# Altium schematic sheet PiCarHat_Master_V2.SchDoc
size A2; SheetNumber: 1; SheetTotal: 1; SPICEModelCacheWKMVAURK: <root> / <DocumentId>WKMVAURK</DocumentId> / </root>
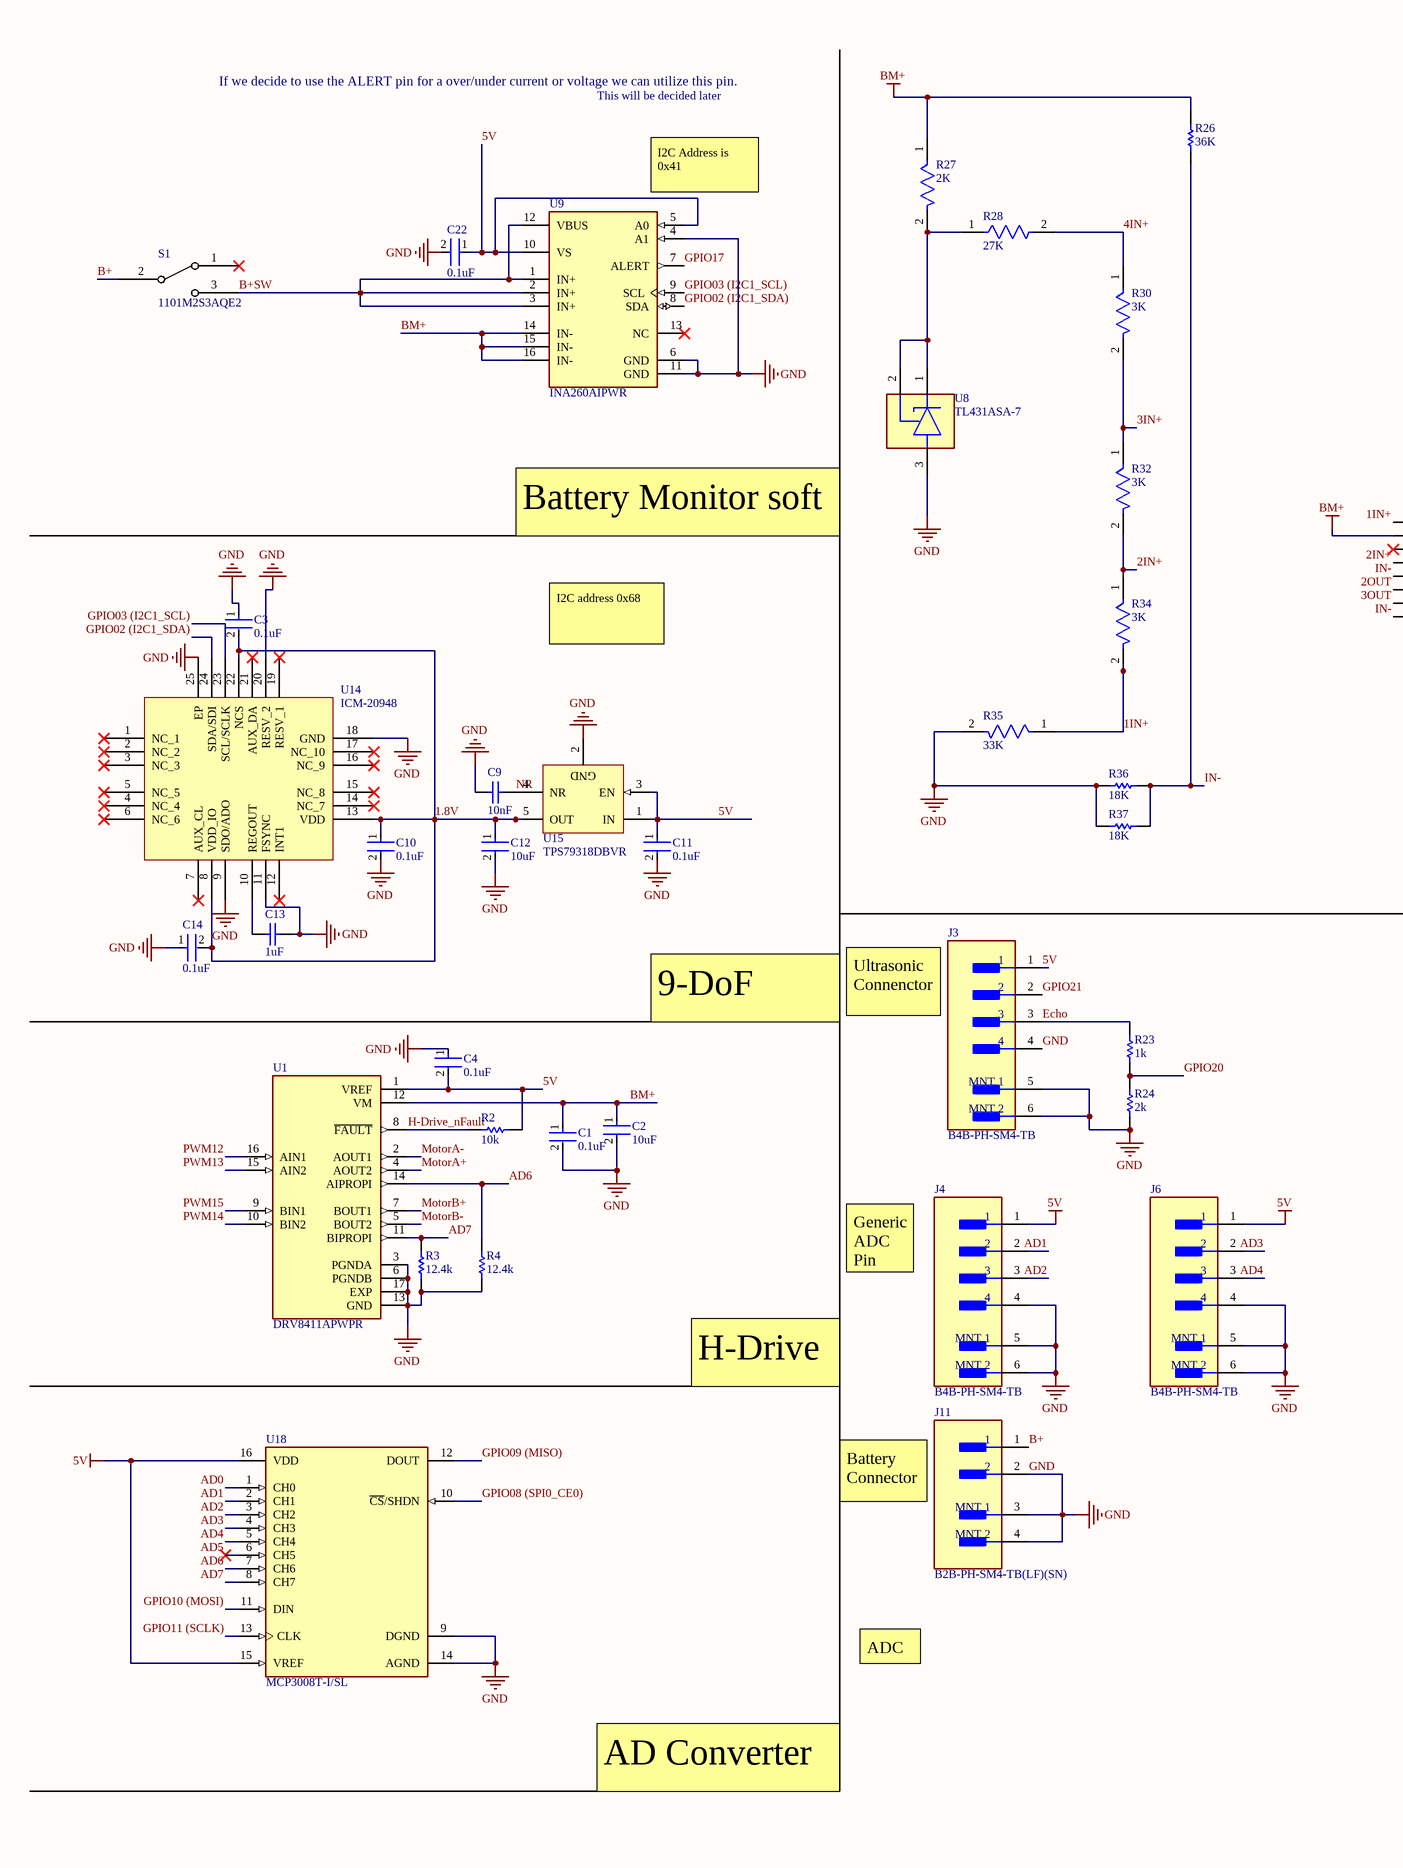
[diagram p0: PiCarHat_Master_V2.SchDoc, left]
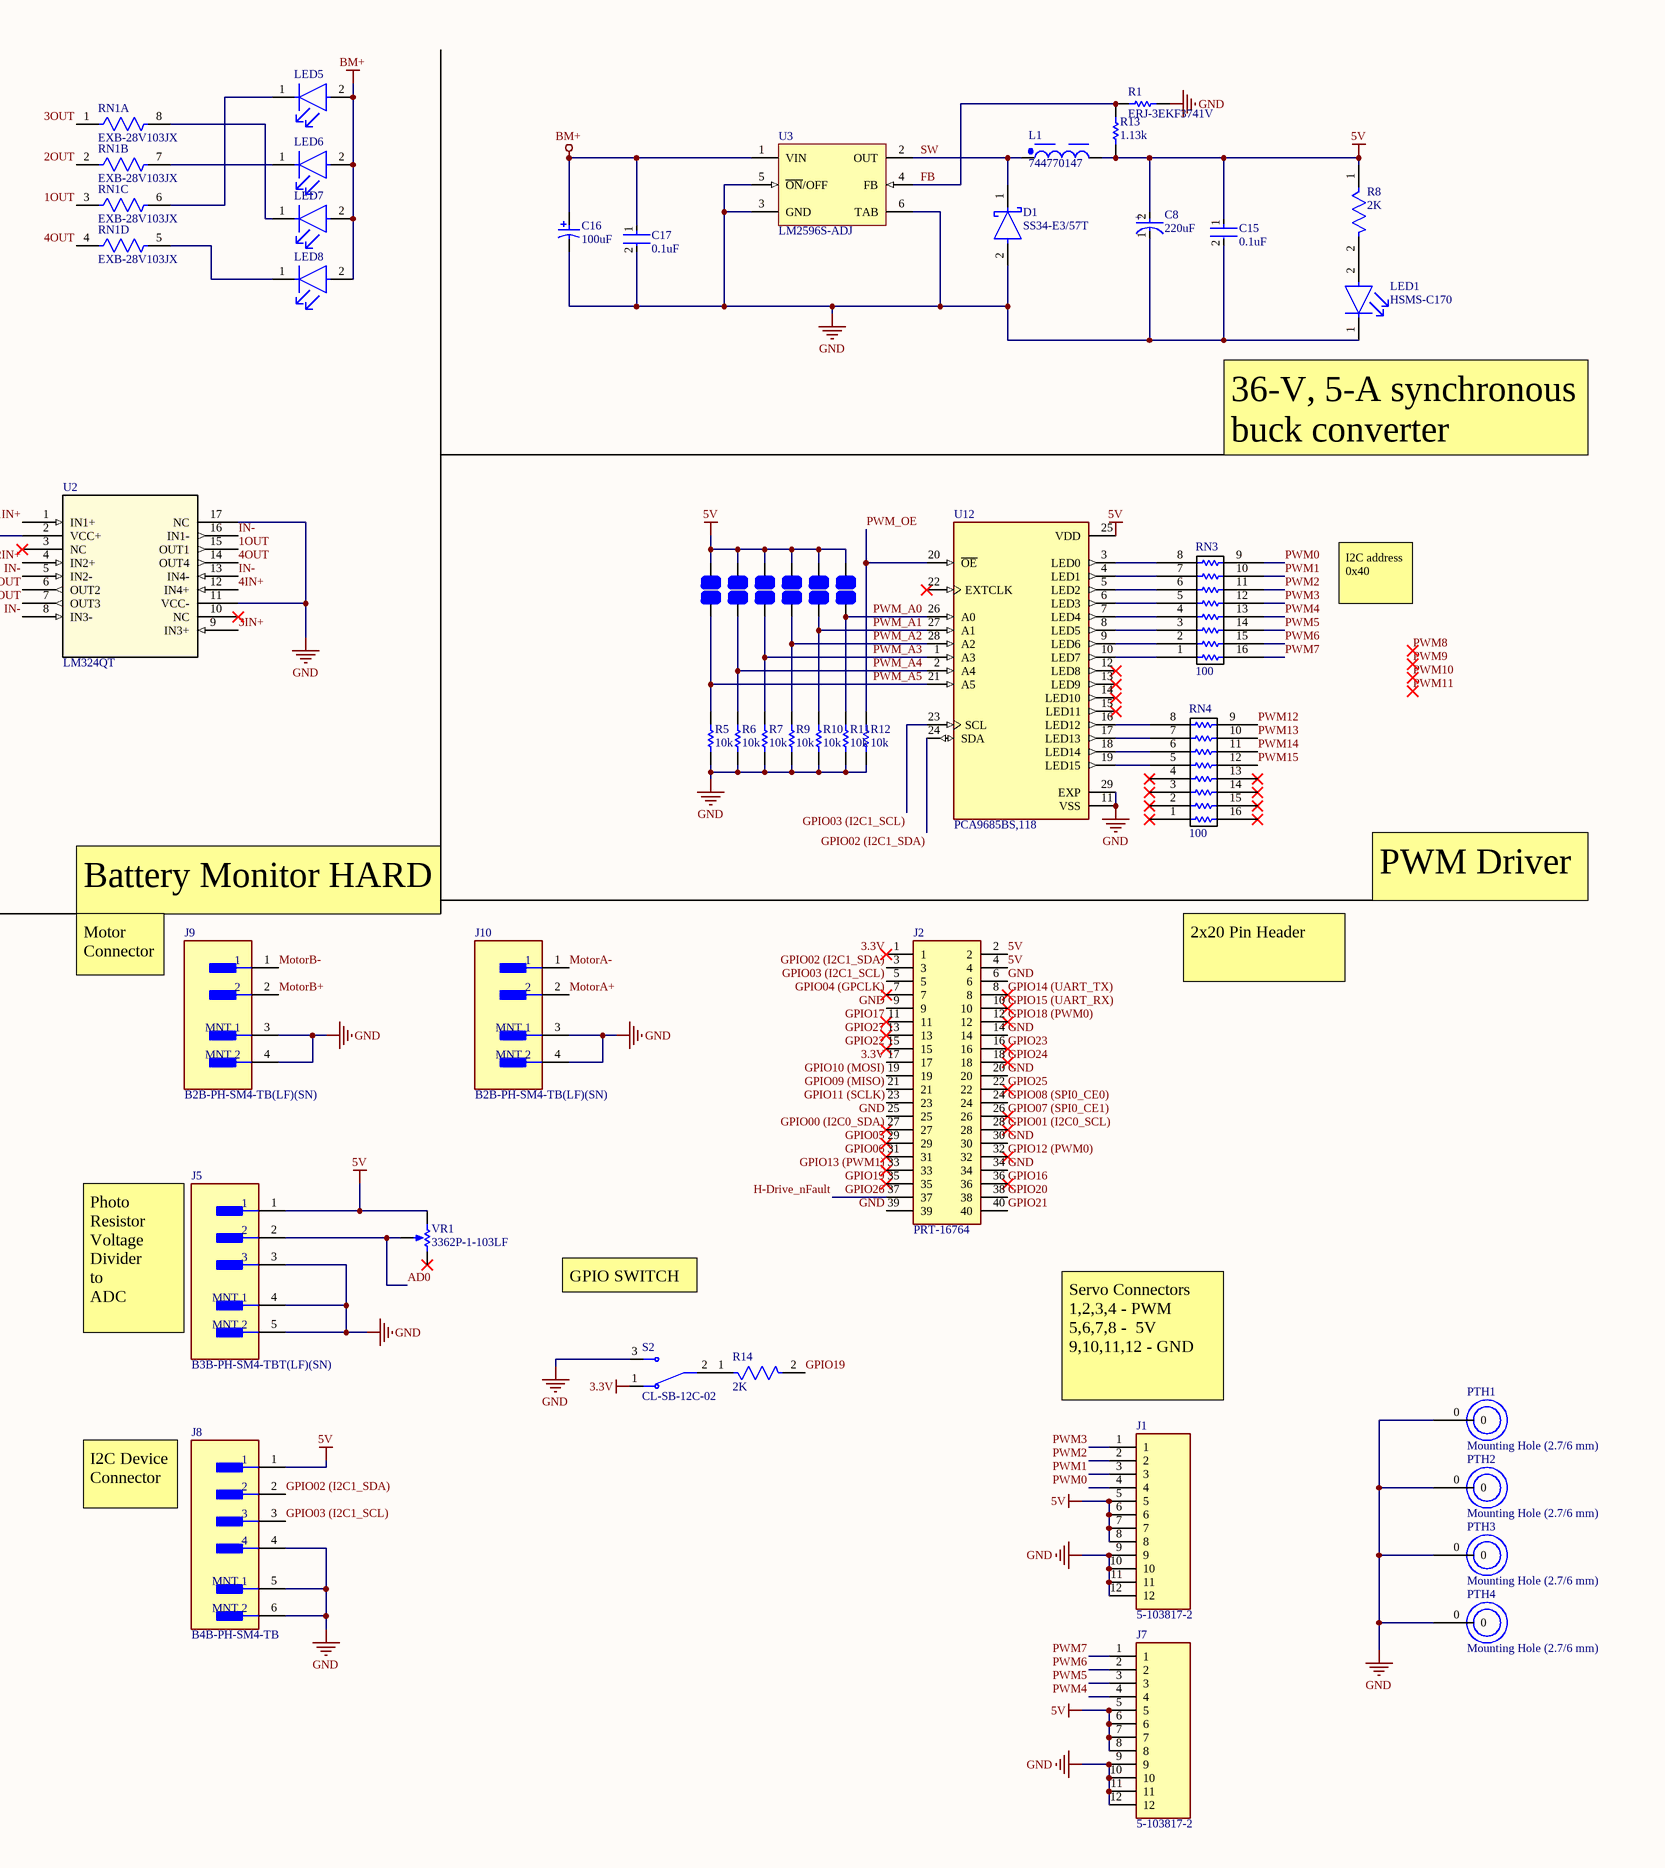
[diagram p1: PiCarHat_Master_V2.SchDoc, right]

## Parts
C1  0.1uF  [FP-C1206C-EB-MFG]
C2  10uF  [FP-GRM21B-0_15-IPC_C]
C3  0.1uF  [FP-C1206C-EB-MFG]
C4  0.1uF  [FP-C1206C-EB-MFG]
C8  220uF  [FP-FKG-MFG]
C9  10nF  [CAPC2013X100X50NL20T25]
C10  0.1uF  [FP-C1206C-EB-MFG]
C11  0.1uF  [FP-C1206C-EB-MFG]
C12  10uF  [FP-GRM21B-0_15-IPC_C]
C13  1uF  [CAPC2013X140X50LL20T25]
C14  0.1uF  [FP-C1206C-EB-MFG]
C15  0.1uF  [FP-C1206C-EB-MFG]
C16  100uF  [PNSC-FK-V-D8_V]
C17  0.1uF  [FP-C1206C-EB-MFG]
C22  0.1uF  [FP-C1206C-EB-MFG]
D1  SS34-E3/57T  [FP-95402-MFG]
J1  5-103817-2  [TE_5-103817-2]
J2  PRT-16764  [RHDR40W64P254_2X20_5130X500X1375P]
J3  B4B-PH-SM4-TB  [FP-B4B-PH-SM4-TB-MFG]
J4  B4B-PH-SM4-TB  [FP-B4B-PH-SM4-TB-MFG]
J5  B3B-PH-SM4-TBT(LF)(SN)  [FP-B3B-PH-SM4-TBT_LF_SN-MFG]
J6  B4B-PH-SM4-TB  [FP-B4B-PH-SM4-TB-MFG]
J7  5-103817-2  [TE_5-103817-2]
J8  B4B-PH-SM4-TB  [FP-B4B-PH-SM4-TB-MFG]
J9  B2B-PH-SM4-TB(LF)(SN)  [FP-B2B-PH-SM4-TB_LF_SN-MFG]
J10  B2B-PH-SM4-TB(LF)(SN)  [FP-B2B-PH-SM4-TB_LF_SN-MFG]
J11  B2B-PH-SM4-TB(LF)(SN)  [FP-B2B-PH-SM4-TB_LF_SN-MFG]
L1  744770147  [WE-PD_1280]
LED1  HSMS-C170  [HSMS-C170-Footprint-1]
LED5  HSMS-C170  [HSMS-C170-Footprint-1]  (value not drawn)
LED6  HSMS-C170  [HSMS-C170-Footprint-1]  (value not drawn)
LED7  HSMS-C170  [HSMS-C170-Footprint-1]  (value not drawn)
LED8  HSMS-C170  [HSMS-C170-Footprint-1]  (value not drawn)
PD1  0805 Solder pads, 51mil x 28mil, Gap 47 mil  [0805 Solder Pads]  (value not drawn)
PD2  0805 Solder pads, 51mil x 28mil, Gap 47 mil  [0805 Solder Pads]  (value not drawn)
PD3  0805 Solder pads, 51mil x 28mil, Gap 47 mil  [0805 Solder Pads]  (value not drawn)
PD4  0805 Solder pads, 51mil x 28mil, Gap 47 mil  [0805 Solder Pads]  (value not drawn)
PD5  0805 Solder pads, 51mil x 28mil, Gap 47 mil  [0805 Solder Pads]  (value not drawn)
PD6  0805 Solder pads, 51mil x 28mil, Gap 47 mil  [0805 Solder Pads]  (value not drawn)
PTH1  Mounting Hole (2.7/6 mm)  [New footprint 1]
PTH2  Mounting Hole (2.7/6 mm)  [New footprint 1]
PTH3  Mounting Hole (2.7/6 mm)  [New footprint 1]
PTH4  Mounting Hole (2.7/6 mm)  [New footprint 1]
R1  ERJ-3EKF3741V  [RESC1608X55X30LL15T15]
R2  10k  [RESC1608X55X25LL10T15]
R3  12.4k  [RESC2013X60X35NL10T20]
R4  12.4k  [RESC2013X60X35NL10T20]
R5  10k  [RESC1608X55X25ML10T15]
R6  10k  [RESC1608X55X25ML10T15]
R7  10k  [RESC1608X55X25ML10T15]
R8  2K  [FP-CRCW0805-e3-MFG]
R9  10k  [RESC1608X55X25ML10T15]
R10  10k  [RESC1608X55X25ML10T15]
R11  10k  [RESC1608X55X25ML10T15]
R12  10k  [RESC1608X55X25ML10T15]
R13  1.13k  [RESC1609X50X30NL10T20]
R14  2K  [FP-CRCW0805-e3-MFG]
R23  1k  [RESC1609X55X30LL10T20]
R24  2k  [RESC1609X55X30LL10T20]
R26  36K  [RESC2113X50X35ML15T15]
R27  2K  [FP-CRCW0805-e3-IPC_B]
R28  27K  [FP-CRCW0805-e3-MFG]
R30  3K  [FP-CRCW0805-e3-IPC_C]
R32  3K  [FP-CRCW0805-e3-IPC_C]
R34  3K  [FP-CRCW0805-e3-IPC_C]
R35  33K  [FP-CRCW0805-e3-IPC_B]
R36  18K  [RESC2013X50X30NL20T20]
R37  18K  [RESC2013X50X30NL20T20]
RN1  EXB-28V103JX  [FP-EXB28V-MFG]  (parts A,B,C,D of 4)
RN3  value 100  [YC248-JR-07100RL-Footprint-2]  (hidden comment: YC248-JR-07100RL)
RN4  value 100  [YC248-JR-07100RL-Footprint-2]  (hidden comment: YC248-JR-07100RL)
S1  1101M2S3AQE2  [1101M2S3AQE2-Footprint-1]
S2  CL-SB-12C-02  [CL-SB-12C-02-Footprint-1]
U1  DRV8411APWPR  [IC_DRV8411APWPR]
U2  LM324QT  [LM324QT-Footprint-1]
U3  LM2596S-ADJ  [TS5B_L]
U8  TL431ASA-7  [FP-SOT23-MFG]
U9  INA260AIPWR  [FP-PW0016A-MFG]
U12  PCA9685BS,118  [QFN65P600X600X100-29N]
U14  ICM-20948  [TDK-QFN-24_L]
U15  TPS79318DBVR  [DBV0005A_M]
U18  MCP3008T-I/SL  [FP-C04-108-MFG]
VR1  3362P-1-103LF  [BOUR-3362P]

## Nets
3.3V: J2.1 J2.17 S2.1(NC)
5V: C4.2 C8.2(A) C11.1 C15.1 C22.1 J1.5 J1.6 J1.7 J1.8 J2.2 J2.4 J3.1 J4.1 J5.1 J6.1 J7.5 J7.6 J7.7 J7.8 J8.1 L1.2 PD1.2 PD2.2 PD3.2 PD4.2 PD5.2 PD6.2 R2.1 R8.1 R13.1 U1.1(VREF) U9.5(A0) U9.10(VS) U12.25(VDD) U15.1(IN) U15.3(EN) U18.15(VREF) U18.16(VDD) VR1.1(CCW)
BM+: C1.1 C2.1 C16.1 C17.1 LED5.2(A) LED6.2(A) LED7.2(A) LED8.2(A) R26.2 R27.1 U1.12(VM) U2.2(VCC+) U3.1(VIN) U9.14(IN-) U9.15(IN-) U9.16(IN-)
GND: C1.2 C2.2 C3.1 C4.1 C8.1(C) C9.1 C10.2 C11.2 C12.2 C13.2 C14.1 C15.2 C16.2 C17.2 C22.2 D1.2(A) J1.9 J1.10 J1.11 J1.12 J2.6 J2.9 J2.14 J2.20 J2.25 J2.30 J2.34 J2.39 J3.4 J3.5(MNT_1) J3.6(MNT_2) J4.4 J4.5(MNT_1) J4.6(MNT_2) J5.3 J5.4(MNT_1) J5.5(MNT_2) J6.4 J6.5(MNT_1) J6.6(MNT_2) J7.9 J7.10 J7.11 J7.12 J8.4 J8.5(MNT_1) J8.6(MNT_2) J9.3(MNT_1) J9.4(MNT_2) J10.3(MNT_1) J10.4(MNT_2) J11.2 J11.3(MNT_1) J11.4(MNT_2) LED1.1(C) PTH1.0 PTH2.0 PTH3.0 PTH4.0 R1.2 R3.1 R4.1 R5.1 R6.1 R7.1 R9.1 R10.1 R11.1 R12.1 R24.2 R35.2 R36.1 R37.1 S2.3(NO) U1.3(PGNDA) U1.6(PGNDB) U1.13(GND) U1.17(EXP) U2.11(VCC-) U2.17(NC) U3.3(GND) U3.5(~{ON}/OFF) U3.6(TAB) U8.3(A) U9.4(A1) U9.6(GND) U9.11(GND) U12.11(VSS) U12.29(EXP) U14.9(SDO/ADO) U14.11(FSYNC) U14.18(GND) U14.20(RESV_2) U14.25(EP) U15.2(GND) U18.9(DGND) U18.14(AGND)
1.8V: C3.2 C10.1 C12.1 C14.2 U14.8(VDD_IO) U14.13(VDD) U14.22(NCS) U15.5(OUT)
1IN+: R34.2 R35.1 U2.1(IN1+)
1OUT: RN1.3 U2.15(OUT1)
2IN+: R32.2 R34.1 U2.4(IN2+)
2OUT: RN1.2 U2.6(OUT2)
3IN+: R30.2 R32.1 U2.9(IN3+)
3OUT: RN1.1 U2.7(OUT3)
4IN+: R28.2 R30.1 U2.12(IN4+)
4OUT: RN1.4 U2.14(OUT4)
AD0: J5.2 U18.1(CH0) VR1.2(S)
AD1: J4.2 U18.2(CH1)
AD2: J4.3 U18.3(CH2)
AD3: J6.2 U18.4(CH3)
AD4: J6.3 U18.5(CH4)
AD5: U18.6(CH5)
AD6: R4.2 U1.14(AIPROPI) U18.7(CH6)
AD7: R3.2 U1.11(BIPROPI) U18.8(CH7)
B+: J11.1 S1.2
B+SW: S1.3 U9.1(IN+) U9.2(IN+) U9.3(IN+) U9.12(VBUS)
Echo: J3.3 R23.1
FB: R1.1 R13.2 U3.4(FB)
GPIO00 (I2C0_SDA): J2.27
GPIO01 (I2C0_SCL): J2.28
GPIO02 (I2C1_SDA): J2.3 J8.2 U9.8(SDA) U12.24(SDA) U14.24(SDA/SDI)
GPIO03 (I2C1_SCL): J2.5 J8.3 U9.9(SCL) U12.23(SCL) U14.23(SCL/SCLK)
GPIO04 (GPCLK): J2.7
GPIO05: J2.29
GPIO06: J2.31
GPIO07 (SPI0_CE1): J2.26
GPIO08 (SPI0_CE0): J2.24 U18.10(~{CS}/SHDN)
GPIO09 (MISO): J2.21 U18.12(DOUT)
GPIO10 (MOSI): J2.19 U18.11(DIN)
GPIO11 (SCLK): J2.23 U18.13(CLK)
GPIO12 (PWM0): J2.32
GPIO13 (PWM1): J2.33
GPIO14 (UART_TX): J2.8
GPIO15 (UART_RX): J2.10
GPIO16: J2.36
GPIO17: J2.11 U9.7(ALERT)
GPIO18 (PWM0): J2.12
GPIO19: J2.35 R14.2
GPIO20: J2.38 R23.2 R24.1
GPIO21: J2.40 J3.2
GPIO22: J2.15
GPIO23: J2.16
GPIO24: J2.18
GPIO25: J2.22
GPIO26: J2.37 R2.2 U1.8(~{FAULT})  [also labelled H-Drive_nFault]
GPIO27: J2.13
IN-: R26.1 R36.2 R37.2 U2.5(IN2-) U2.8(IN3-) U2.13(IN4-) U2.16(IN1-)
MotorA+: J10.2 U1.4(AOUT2)
MotorA-: J10.1 U1.2(AOUT1)
MotorB+: J9.2 U1.7(BOUT1)
MotorB-: J9.1 U1.5(BOUT2)
NR: C9.2 U15.4(NR)
PWM0: J1.4 RN3.9
PWM1: J1.3 RN3.10
PWM2: J1.2 RN3.11
PWM3: J1.1 RN3.12
PWM4: J7.4 RN3.13
PWM5: J7.3 RN3.14
PWM6: J7.2 RN3.15
PWM7: J7.1 RN3.16
PWM12: RN4.9 U1.16(AIN1)
PWM13: RN4.10 U1.15(AIN2)
PWM14: RN4.11 U1.10(BIN2)
PWM15: RN4.12 U1.9(BIN1)
PWM_A0: PD6.1 R11.2 U12.26(A0)
PWM_A1: PD5.1 R10.2 U12.27(A1)
PWM_A2: PD4.1 R9.2 U12.28(A2)
PWM_A3: PD3.1 R7.2 U12.1(A3)
PWM_A4: PD2.1 R6.2 U12.2(A4)
PWM_A5: PD1.1 R5.2 U12.21(A5)
PWM_OE: R12.2 U12.20(~{OE})
SW: D1.1(C) L1.1 U3.2(OUT)
NetC13_1: C13.1 U14.10(REGOUT)
NetLED1_2: LED1.2(A) R8.2
NetLED5_1: LED5.1(C) RN1.6
NetLED6_1: LED6.1(C) RN1.7
NetLED7_1: LED7.1(C) RN1.8
NetLED8_1: LED8.1(C) RN1.5
NetR14_1: R14.1 S2.2(COM)
NetR27_2: R27.2 R28.1 U8.1(C) U8.2(REF)
NetRN3_1: RN3.1 U12.10(LED7)
NetRN3_2: RN3.2 U12.9(LED6)
NetRN3_3: RN3.3 U12.8(LED5)
NetRN3_4: RN3.4 U12.7(LED4)
NetRN3_5: RN3.5 U12.6(LED3)
NetRN3_6: RN3.6 U12.5(LED2)
NetRN3_7: RN3.7 U12.4(LED1)
NetRN3_8: RN3.8 U12.3(LED0)
NetRN4_5: RN4.5 U12.19(LED15)
NetRN4_6: RN4.6 U12.18(LED14)
NetRN4_7: RN4.7 U12.17(LED13)
NetRN4_8: RN4.8 U12.16(LED12)

Not connected (* = marked no-connect by the designer): RN4 1(8)* 2(7)* 3(6)* 4(5)* 13(12)* 14(11)* 15(10)* 16(9)*; S1 1*; U2 3(NC)* 10(NC)*; U9 13(NC)*; U12 12(LED8)* 13(LED9)* 14(LED10)* 15(LED11)* 22(EXTCLK)*; U14 1(NC_1)* 2(NC_2)* 3(NC_3)* 4(NC_4)* 5(NC_5)* 6(NC_6)* 7(AUX_CL)* 12(INT1)* 14(NC_7)* 15(NC_8)* 16(NC_9)* 17(NC_10)* 19(RESV_1)* 21(AUX_DA)*; VR1 3(CW)*

## Notes on the sheet
- If we decide to use the ALERT pin for a over/under current or voltage we can utilize this pin.
- This will be decided later
- (near U9) I2C Address is 0x41
- (near LED1) 36-V, 5-A synchronous buck converter 12-WSON -40 to 150
- Battery Monitor soft
- I2C address 0x40
- I2C address 0x68
- Battery Monitor HARD
- PWM Driver
- Motor
  Connector
- 2x20 Pin Header
- 9-DoF IMU
- Ultrasonic
  Connenctor
- Generic
  ADC
  Pin
- Photo
  Resistor
  Voltage
  Divider
  to
  ADC
- GPIO SWITCH
- H-Drive
- (near J1) Servo Connectors
  1,2,3,4 - PWM
  5,6,7,8 -  5V
  9,10,11,12 - GND
- Battery
  Connector
- I2C Device
  Connector
- ADC
- AD Converter
- Labels drawn without touching a wire or pin: PWM8, PWM9, PWM10, PWM11
- (in symbol CMP-05427-000014-1) +

## Library data of the parts
C1 C3 C4 C10 C11 C14 C15 C17 C22 = CMP-03020-000153-1: CAP CER 0.1UF 100V X7R 1206; Manufacturer: KEMET; Manufacturer Part Number: C1206C104K1RACTU; Value: 0.10 μF; Tolerance: 0.1; Description: C1206 0.10 μF X7R 10.00% 100 V; Material: Ceramic; Temperature Coefficient: 15%; Automotive Grade: Grade 0; Voltage Rating: 100 V; Automotive: Yes; Ipc Land Pattern Name: CAPC320160X78; Device Class L1: Passive Components; ComponentLink2Description: Datasheet; Temperature Range Low: -55°C; Category: Cap; Octopart: https://octopart.com/c1206c104k1ractu-kemet-89521; Height: 0.88mm; Lead Free: Yes; Digikey Description: CAP CER 0.1UF 100V X7R 1206; Mouser Description: CAP CER 0.1UF 100V X7R 1206; Device Class L3: Ceramic Capacitors; Device Class L2: Capacitors; ComponentLink2URL: https://content.kemet.com/datasheets/KEM_C1007_X8R_ULTRA_150C_SMD.pdf; Temperature Range High: +150°C; Temperature Characteristic: X7R; RoHS: TRUE; Capacitance: 0.10 μF; Package: C1206C-EB; Temperature: -55°C to +150°C; Part Number: C1206C104K1RACTU
C2 C12 = CMP-2007-03541-2: Chip Multilayer Ceramic Capacitors for General Purpose, 0805, 10uF, X5R, 15%, 10%, 25V; Part Number: GRM21BR61E106KA73L; Length: 2mm; Depth: 1.25mm; Termination: SMD/SMT; Voltage: 25V; Height: 1.25mm; Material: Ceramic; Thickness: 0.053inch; Radiation Hardening: No; Min Operating Temperature: -55°C; Width: 0.049inch; Package Quantity: 1; Mount: Surface Mount; Dielectric: X5R; Packaging: Tape and Reel; Capacitance: 10uF; Voltage Rating (DC): 25V; Lead Free: Lead Free; Max Operating Temperature: 85°C; Case Code (Imperial): 0805; Case/Package: 0805; Tolerance: 10%; Voltage Rating: 25V; Case Code (Metric): 2012
C8 = CMP-05427-000014-1: CAP ALUM 220UF 20% 50V SMD; Manufacturer: Panasonic; Manufacturer Part Number: EEEFK1H221P; Part Number: EEE-FK1H221P; Material: Aluminum; Leakage Current: 110uA; Ripple Current: 670mA; Life: 2000Hours; Esr: 0.18Ω; Automotive Grade: Grade 2; Dissipation Factor: 10%; Tolerance: 20%; Device Class L3: Aluminum Electrolytic Capacitors; ComponentLink2Description: Datasheet; Temperature Range High: +105°C; Digikey Description: CAP ALUM 220UF 20% 50V SMD; Temperature: -55°C to +105°C; Temperature Range Low: -55°C; Height: 10.5mm; Voltage Rating: 50V; Value: 220uF; Capacitance: 220uF; Automotive: Yes; ComponentLink2URL: https://industrial.panasonic.com/cdbs/www-data/pdf/RDE0000/ABA0000C1181.pdf; Package: FKG; Device Class L2: Capacitors; Lead Free: Yes; Device Class L1: Passive Components; RoHS: TRUE; Mouser Description: Cap Aluminum Lytic 220uF 50V 20% (10 X 10.2mm) SMD 670mA 2000h 105C Automotive T/R; Octopart: https://octopart.com/eeefk1h221p-panasonic-1332836; Category: Cap
C9 = CMP-2007-03708-1: 50V 10nF X7R ±10% 0805 Multilayer Ceramic Capacitors MLCC - SMD/SMT ROHS; Part Number: C0805F103K5RACTU; Manufacturer: Kemet
C13 = CMP-2007-03234-1: 25V 1uF X7R ±10% 0805 Multilayer Ceramic Capacitors MLCC - SMD/SMT ROHS; Part Number: C0805C105K3RACTU; Manufacturer: Kemet
C16 = CMP-2000-06206-1: Aluminum Electrolytic Capacitor, 100 uF, +/- 20%, 25 V, 2-Pin SMD (Size Code D8), -55 to 105 degC, RoHS, Tape and Reel; Manufacturer: Panasonic; Part Number: EEE-FK1E101XP; Type: Can; Lifetime@Temperature: 2000Hrs@105°C; Capacitance: 100µF; Rated Voltage: 25V; Ripple Current: 280mA; Impedance: 0.34O; Case Size/Dimension: Ø6.3x7.7mm; Operating Temp-Max: 105°C; Series: FK; Package URL: http://industrial.panasonic.com/cdbs/www-data/pdf/RDE0000/DME0000COL48.pdf; Mounting Technology: SurfaceMount; Package Description: 2-Pin Electrolytic Aluminum Capacitor, Body 6.6 x 6.6 mm; Datasheet Version: 03/2016; Datasheet URL: http://industrial.panasonic.com/cdbs/www-data/pdf/RDE0000/ABA0000C1181.pdf; Manufacturer URL: http://www.panasonic.com/; Package Reference: FK-V-D8; Operating Temp Range: -55to+105°C
D1 = CMP-02539-000012-1: DIODE SCHOTTKY 40V 3A DO214AB; Manufacturer: Vishay; Max Junction Temp: +150°C; Peak Reverse Current: 0.5mA; Max Surge Forward Current: 100A; Standoff Height: 0mm; ComponentLink2Description: Datasheet; Device Class L3: Schottky Diodes; Height: 2.62mm; Max Repetitive Reverse Voltage: 40V; Lead Free: Yes; Package: 95402; Temperature Range High: +150°C; ComponentLink2URL: http://www.vishay.com/docs/88751/ss32.pdf; Temperature: -55°C to +150°C; Footprint Url: http://www.vishay.com/docs/95402/smc.pdf; Automotive: No; Forward Current: 3A; Category: Diode; Manufacturer Part Number: SS34-E3/57T; RoHS: TRUE; Device Class L2: Diodes; Mouser Description: Schottky Diodes & Rectifiers 3.0 Amp 40 Volt; Octopart: https://octopart.com/ss34-e3%2F57t-vishay-39552907; Temperature Range Low: -55°C; Device Class L1: Discrete Semiconductors; Digikey Description: DIODE SCHOTTKY 40V 3A DO214AB; Part Number: SS34-E3/57T
J1 J7 = CMP-023-000000-3: 12 MODII HDR 3RST UNSHRD .100; Part Number: TSW-104-07-L-T; Centerline_Pitch: 2.54 mm[.1 in]; Number_of_Positions: 12; MF: TE Connectivity; Product_Type: Connector; DigiKey-Purchase-URL: https://snapeda.com/shop?store=DigiKey&id=1068516; Source: 5-103817-2.SchLib; Arrow_Electronics-Purchase-URL: https://snapeda.com/shop?store=Arrow+Electronics&id=1068516; EU_RoHS_Compliance: Compliant; Price: None; Availability: Unavailable; MP: 5-103817-2; Pin Count: 12; Package: None; SnapEDA_Link: https://www.snapeda.com/parts/5-103817-2/TE%20Connectivity%20AMP%20Connectors/view-part/1068516/?ref=snap; Design Item ID: 5-103817-2; Component Type: Standard; Mouser-Purchase-URL: https://snapeda.com/shop?store=Mouser&id=1068516
  J1: Value: *
J2 = PRT-16764: Connector; Manufacturer_Name: SparkFun; Datasheet Link: https://cdn.sparkfun.com/assets/0/8/d/b/2/DS-16764-2_X_20_Pin_Extended_GPIO_Header_-_Female_-_13.5mm_9.80mm.pdf; Height: 13.75mm; Part Number: PRT-16764; Mouser Part Number: 474-PRT-16764; Mouser Price/Stock: https://www.mouser.co.uk/ProductDetail/SparkFun/PRT-16764?qs=W%2FMpXkg%252BdQ4FKwyaXnhaEw%3D%3D; Arrow Part Number: PRT-16764; Arrow Price/Stock: null?region=nac
J3 J4 J6 J8 = CMP-002-00074-1: 2.0mm pitch/Disconnectable Insulation displacement and Crimp style connectors; Part Number: B4B-PH-SM4-TB
J5 = CMP-002-00072-1: Connector Header, PH Series, 3 Position, 2.00mm, 100V, Surface Mount, Solder, Pick and Place, Natural.; Part Number: B3B-PH-SM4-TB
J9-J11 = CMP-002-00073-1: Connector Header, PH Series, 2 Position, 2.00mm, 100V, Surface Mount, Solder, Natural; Part Number: B2B-PH-SM4-TB
L1 = CMP-0227-00205-2: NexarPartId: 8917149; Resistance: 100mΩ; Shielding: Shielded; Saturation Current: 3A; Inductance: 47µH; Self Resonant Frequency: 7.9MHz; Tolerance: 20%; DC Resistance (DCR): 53mΩ; Test Frequency: 1kHz; Max DC Current: 2.7A; Core Material: Ferrite; Depth: 12mm; Ambient Temperature Range High: 85°C; Height - Seated (Max): 8.001mm; Max Operating Temperature: 125°C; Weight: 4.535924g; Series Resistance: 100mΩ; RoHS: Compliant; Mount: Surface Mount; Case/Package: Nonstandard; Width: 12mm; Ambient Temperature Range Low: -40°C; Current Rating: 3A; Height: 8mm; Packaging: Cut Tape (CT); Length: 12mm; Number of Pins: 2; Termination: SMD/SMT; Lead Pitch: 7mm; Lead Free: Lead Free; Inductance Tolerance: 20%; Min Operating Temperature: -40°C; REACH SVHC: Unknown; RMS Current (Irms): 2.7A; Composition: Wirewound; Part Number: 744770147
LED1 LED5-LED8 = CMP-007-00037-3: Single Color LED, High Efficiency Red, Untinted Diffused, 1.4mm; Forward Voltage: 2.6V; Forward Current: 20mA; RoHS Compliant: Yes; Min Operating Temperature: -40°C; Pins: 2; Max Operating Temperature: 85°C; Mounting Technology: Surface Mount; Part Number: HSMS-C170
PD1-PD6 = 0805 Pads: P&P Comment: DO NOT PLACE; Part Number: *
PTH1-PTH4 = CMP-00030-00001-4: Mounting Hole with inner diameter of 2.7mm and outer diameter of 6mm (Made for Rasberry Pi 4b; P&P Comment: NO NOT PLACE; Part Number: *
R1 = CMP-2000-00466-1: Manufacturer: Panasonic; Part Number: ERJ-3EKF3741V
R2 R5-R7 R9-R12 = CMP-2000-05022-1: Resistor, 10 KOhm, +/- 5%, 100 mW, -55 to 155 degC, 0603 (1608 Metric), RoHS, Tape and Reel - RC0603JR-0710KL; Manufacturer: Yageo; Resistance: 10kOhms; Voltage Rating: 50V; Temperature Coefficient: 100PPM/C; Power Rating: 100mW; Package Reference: 603; Series: RC; Case Code - mm: 1608; Packaging: Reel; Datasheet URL: http://www.farnell.com/datasheets/443971.pdf; Datasheet Version: Rev. 4, 04/2009; Operating Temperature Range: -55Cto+155C; Product: ThickFilmResistorsGeneralPurpose; Package Description: 2-Pin Surface Mount Device, Body 1.6 x 0.8 mm; Manufacturer URL: http://www.yageo.com/; Case Code - in: 0603; Tolerance: 5%; Termination Style: SMD/SMT; Part Number: RC0603JR-0710KL
R3 R4 = CMP-2001-00911-1: RC0805FR-0712K4L / Fixed Resistor, Metal Glaze/thick Film, 0.125W, 12400ohm, 150V, 1% +/-Tol, 100ppm/Cel, Surface Mount, 0805; Manufacturer: Yageo; Part Number: RC0805FR-0712K4L
R8 R14 R27 = CMP-2001-03755-2: RES Thick Film, 2kΩ, 1%, 0.125W, 100ppm/°C, 0805; Part Number: CRCW08052K00FKEA; Working Voltage: 150V; Max Power Dissipation: 125mW; Resistance: 2kR; Package Quantity: 10; Case Code (Metric): 2012; Voltage Rating: 150V; Number of Terminations: 2; Max Operating Temperature: 155°C; Depth: 1.25mm; Tolerance: 1%; Power Rating: 125mW; Lead Free: Lead Free; Case/Package: 0805; Features: Automotive AEC-Q200; Min Operating Temperature: -55°C; Termination: SMD/SMT; Case Code (Imperial): 0805; Weight: 0.000194oz; Packaging: Tape and Reel; Military Standard: Not; Radiation Hardening: No; Contact Plating: Tin; Mount: Surface Mount; Temperature Coefficient: 100ppm/°C; Height: 0.02inch; Number of Terminals: 2; Voltage Rating (DC): 150V; Number of Pins: 2; Length: 2mm; Width: 1.25mm; Composition: Thick Film; Part: *
R13 = CMP-2000-02979-1: Fixed Resistor, Metal Glaze/thick Film, 0.1W, 1130ohm, 75V, 1% +/-Tol, 100ppm/Cel, Surface Mount, 0603; Part Number: CRCW06031K13FKEA; Manufacturer: Vishay Dale
R23 = CMP-2000-03719-1: TNPW06031K00BETA / 100mW Thin Film Resistor ±25ppm/℃ ±0.1% 1kΩ 0603  Chip Resistor - Surface Mount ROHS; Manufacturer: Vishay Dale; Part Number: TNPW06031K00BETA
R24 = CMP-2000-03747-1: TNPW06032K00BEEA / 125mW Thin Film Resistor ±25ppm/℃ ±0.1% 2kΩ 0603  Chip Resistor - Surface Mount ROHS; Manufacturer: Vishay Dale; Part Number: TNPW06032K00BEEA
R26 = CMP-2001-03847-3: Chip Resistor, 36 KOhm, +/- 1%, 0.125 W, -55 to 155 degC, 0805 (2012 Metric), RoHS, Tape and Reel; Manufacturer: Vishay Semiconductor; Part Number: CRCW080536K0FKEA; Voltage Rating: 150 V; ComponentLink2Description: Datasheet; Package Quantity: 5000; Min Operating Temperature: -55 degC; Height: 0.45 mm; ComponentLink2URL: http://www.farnell.com/datasheets/1697337.pdf; REACH SVHC: Unknown; ComponentLink1Description: Manufacturer URL; Length: 2 mm; Packaging: Tape and Reel; Mount: Surface Mount; RoHSCompliant: true; PackageReference: 0805; Max Operating Temperature: 155 degC; ComponentLink1URL: http://www.vishay.com/; DatasheetVersion: 06/2012; Mounting Technology: Surface Mount; Pins: 2; PackageDescription: 2-Pin Surface Mount Device, Body 2.05 x 1.25 mm
R28 = CMP-2001-03741-2: RES Thick Film, 27kΩ, 1%, 0.125W, 100ppm/°C, 0805; Part Number: CRCW080527K0FKEA; Power Rating: 125mW; Voltage Rating: 150V; Resistance: 27kR; Termination: SMD/SMT; Max Power Dissipation: 125mW; Temperature Coefficient: 100ppm/°C; Technology: THICK FILM; Depth: 1.25mm; Number of Pins: 2; Height: 0.45mm; Features: Automotive AEC-Q200; Package Quantity: 10; Weight: 0.000194oz; Military Standard: Not; Case Code (Imperial): 0805; Packaging: Tape and Reel; Resistor Type: Thick Film; Mount: Surface Mount; Number of Terminations: 2; Max Operating Temperature: 155°C; Resistance Tolerance: 1%; Size Code: 0805; Radiation Hardening: No; Width: 0.049inch; Voltage Rating (DC): 150V; Min Operating Temperature: -55°C; Series: CRCW; Length: 2mm; Contact Plating: Tin; Lead Free: Lead Free; RoHS Compliant: Yes; Case/Package: 0805; Case Code (Metric): 2012; Construction: Rectangular; Tolerance: 1%
R30 R32 R34 = CMP-2001-03869-2: RES Thick Film, 3kΩ, 1%, 0.125W, 100ppm/°C, 0805; Part Number: CRCW08053K00FKEA; Power Rating: 125mW; Working Voltage: 150V; Resistance: 3kR; Features: Automotive AEC-Q200; Military Standard: Not; Case/Package: 0805; Radiation Hardening: No; Packaging: Tape and Reel; Number of Terminations: 2; Depth: 1.25mm; Termination: SMD/SMT; Max Operating Temperature: 155°C; Min Operating Temperature: -55°C; Case Code (Imperial): 0805; Width: 1.25mm; Lead Free: Lead Free; Package Quantity: 10; Voltage Rating (DC): 150V; Temperature Coefficient: 100ppm/°C; Height: 0.45mm; Max Power Dissipation: 125mW; Length: 2mm; Voltage Rating: 150V; Tolerance: 1%; Weight: 0.000194oz; Composition: Thick Film; Case Code (Metric): 2012; Contact Plating: Tin
R35 = CMP-2001-03827-2: RES Thick Film, 33kΩ, 1%, 0.125W, 100ppm/°C, 0805; Part Number: CRCW080533K0FKEA; Power Rating: 125mW; Voltage Rating (DC): 150V; Resistance: 33kR; Radiation Hardening: No; Termination: SMD/SMT; Military Standard: Not; Packaging: Tape and Reel; Temperature Coefficient: 100ppm/°C; Lead Free: Lead Free; Max Power Dissipation: 125mW; Features: Automotive AEC-Q200; Composition: Thick Film; Voltage Rating: 150V; Package Quantity: 5000; Max Operating Temperature: 155°C; Weight: 0.000194oz; Case/Package: 0805; Case Code (Imperial): 0805; Length: 2mm; Height: 0.45mm; Min Operating Temperature: -55°C; Contact Plating: Tin; Case Code (Metric): 2012; Tolerance: 1%; Number of Terminations: 2; Width: 1.25mm; Depth: 1.25mm
R36 R37 = CMP-2001-03588-1: CRCW080518K0FKEA / 125mW Thick Film Resistors 150V ±1% ±100ppm/℃ 18kΩ 0805  Chip Resistor - Surface Mount ROHS; Manufacturer: Vishay Dale; Part Number: CRCW080518K0FKEA
RN1 = CMP-2000-06233-2: RES ARRAY 4 RES 10K OHM 0804; Part Number: EXB-28V103JX Panasonic; Number of Resistors: 4; Resistance: 10kR; Voltage Rating: 50V; Circuit Type: Isolated; Number of Contacts: 8; Power Dissipation: 63mW; Voltage Rating (DC): 100V; Power Per Element: 62.5mW; Resistance Tolerance: 5%; Temperature Coefficient: 200ppm/°C; Lead Free: Lead Free; Depth: 1mm; Length: 2mm; Package Quantity: 1; Number of Elements: 4; Military Standard: Not; Packaging: Tape and Reel; Technology: THICK FILM; Height: 0.35mm; RoHS Compliant: Yes; Termination: Convex; Number of Pins: 8; Case Code (Metric): 1005; Series: EXB; Size Code: 0402; Min Operating Temperature: -55°C; Max Operating Temperature: 125°C; Radiation Hardening: No; Tolerance: 5%; Number of Terminals/Pins: 8; Case/Package: 0804; Mount: Surface Mount; Terminal Pitch: 0.5mm; Width: 0.039inch; Case Code (Imperial): 0402
RN3 RN4 = CMP-009-00178-4: Array/Network Resistor, Isolated, Metal Glaze/thick Film, 100ohm, 50V, 5% +/-Tol, 200ppm/Cel, Surface Mount, 1606; Max Operating Temperature: 155°C; Tolerance: 5%; RoHS Compliant: Yes; Case/Package: 1606; Min Operating Temperature: -55°C; Mounting Technology: Surface Mount; Pins: 16; Part Number: YC248-JR-07100RL
S1 = CMP-011-00016-3: Switch, SPDT, Horizontal, 6A, 28VDC, Through Hole-right Angle; Min Operating Temperature: -30°C; Max Operating Temperature: 65°C; Mounting Technology: Through Hole; Part Number: 1101M2S3AQE2
S2 = CMP-011-00017-1: Slide Switch; Part Number: CL-SB-12C-02; RoHS Compliant: Yes
U1 = CMP-021-000000-3: 1.65-V to 11-V, 4-A dual H-bridge motor driver with IPROPI current regulation; MF: Texas Instruments; Package: TSSOP-16 Texas Instruments; Design Item ID: DRV8411APWPR; MP: DRV8411APWPR; Pin Count: 17; Source: DRV8411APWPR.SchLib; Check_prices: https://www.snapeda.com/parts/DRV8411APWPR/Texas+Instruments/view-part/?ref=eda; Component Type: Standard; Value: *; SnapEDA_Link: https://www.snapeda.com/parts/DRV8411APWPR/Texas+Instruments/view-part/?ref=snap; Part Number: DRV8411APWPR
U2 = CMP-014-00002-3: Operational Amplifier, 4 Func, 9000uV Offset-Max, BIPolar, PQCC16; Channels: 4; Nominal Supply Voltage: 5V; RoHS Compliant: Yes; Min Operating Temperature: 0°C; Max Operating Temperature: 70°C; Pins: 16; Case/Package: HVQCCN; Part Number: LM324QT
U3 = CMP-0069-00272-2: SIMPLE SWITCHER® Power Converter 150 KHz 3A Step-Down Voltage Regulator, 5-pin TO-263; Manufacturer: National Semiconductor; Part Number: 4518-LM2596S-ADJTR-ND; PackageTopMarking: NSUZXYTTE#*LM2596S*-ADJ P+; PowerWise: N; ComponentLink1Description: LM2596 Datasheet; RoHS: N; PackageVersion: revD, Apr-2005; DatasheetVersion: May-2002; ComponentLink2Description: LM2596 Web Page; ComponentLink2URL: http://www.national.com/pf/LM/LM2596.html; RevisionNote: Component URLs added; PackageDescription: TO-263, Molded, .400 x .390 x .180in, 5 Lead, .067in Pitch, Surface Mount; ComponentLink3Description: TS5B Package Page; ComponentLink1URL: http://www.national.com/ds/LM/LM2596.pdf; PackageReference: TS5B; Code_JEDEC: MO-169-AB; PinCount: 5; ComponentLink3URL: http://www.national.com/packaging/folders/ts5b.html; CompType: Switcher
U8 = CMP-12755-000001-1: IC VREF SHUNT ADJ SOT23-3; Manufacturer: DIODES INC.; Standoff Height: 0.013mm; Max Power Dissipation: 330mW; Max Junction Temp: +150°C; Output Type: AdjustableProgrammable; Octopart: https://octopart.com/tl431asa-7-diodes+inc.-18832779; Automotive: No; Digikey Description: IC VREF SHUNT ADJ SOT23-3; Temperature: to +150°C; Ambient Temperature Range High: +125°C; Ipc Land Pattern Name: SOT92P240X102-3; ComponentLink2URL: https://www.diodes.com/assets/Datasheets/TL431_432.pdf; RoHS: TRUE; Manufacturer Part Number: TL431ASA-7; Reference Type: Shunt; Mouser Description: V-Ref Adjustable 2.495V to 36V 100mA 3-Pin SOT-23 T/R; Package: SOT23; Ambient Temperature Range Low: -40°C; Device Class L3: Voltage References; Temperature Range High: +150°C; ComponentLink2Description: Datasheet; Footprint Url: https://www.diodes.com/assets/Package-Files/SOT23.pdf; Category: IC; Device Class L2: Power Management ICs; Device Class L1: Integrated Circuits (ICs); Lead Free: Yes; Height: 1.1mm; Part Number: TL431ASA-7
U9 = CMP-04910-000015-1: IC MONITOR PWR/CURR 16TSSOP; Manufacturer: Texas Instruments; Nominal Supply Current: 310uA; Max Junction Temp: +150°C; Standoff Height: 0.05mm; Max Supply Voltage: 5.5V; Min Supply Voltage: 2.7V; Output Current: 10mA; Ambient Temperature Range High: +125°C; ComponentLink2Description: Datasheet; Manufacturer Part Number: INA260AIPWR; Automotive: No; RoHS: TRUE; Lead Free: Yes; Package: PW0016A; Device Class L2: Power Management ICs; Temperature Range Low: -40°C; Digikey Description: IC MONITOR PWR/CURR 16TSSOP; Height: 1.2mm; Temperature: -40°C to +125°C; Device Class L1: Integrated Circuits (ICs); Device Class L3: unset; Octopart: https://octopart.com/ina260aipwr-texas+instruments-75199489; Category: IC; Ambient Temperature Range Low: -40°C; Temperature Range High: +125°C; ComponentLink2URL: http://www.ti.com/lit/ds/symlink/ina260.pdf; Part Number: INA260AIPWR
U12 = PCA9685BS,118: LED Driver IC 16 Output Linear PWM Dimming 25mA 28-HVQFN (6x6); MF: NXP USA; Price: None; Package: HVQFN-28 NXP Semiconductors; MP: PCA9685BS,118; Availability: Unavailable; SnapEDA_Link: https://www.snapeda.com/parts/PCA9685BS,118/NXP%20USA%20Inc./view-part/215271/?ref=snap; Value: *; Part Number: PCA9685BS,118
U14 = CMP-031-00007-3: Accelerometer and Gyroscope Compass 9-Axis Digital 24-Pin QFN T/R; Max Supply Voltage: 3.6V; Min Supply Voltage: 1.71V; Mounting Technology: Surface Mount; Max Operating Temperature: 85°C; Case/Package: QFN; Min Operating Temperature: -40°C; Part Number: ICM-20948
U15 = CMP-0394-00328-2: Single Output High PSRR LDO, 200 mA, Fixed 1.8 V Output, 2.7 to 5.5 V Input, 5-pin SOT-23 (DBV), -40 to 85 degC, Green (RoHS & no Sb/Br); Manufacturer: Texas Instruments; Vdo(Typ)(mV): 112; SubFamily: Single Channel LDO; Iq(Typ)(mA): 0.2; Vin(Max)(V): 5.5; Accuracy(%): 2; Rating: Catalog; Vin(Min)(V): 2.7; Vout Adj(Max)(V): 1.8; ComponentLink3URL: http://www.ti.com/litv/pdf/mpds018i; PackageVersion: 4073253-4/K; Eco-Plan: Green (RoHS & no Sb/Br); ComponentLink3Description: Package Specification; PackageDescription: 5-Pin Plastic Small Outline, Body 1.60 Ãƒâ€” 2.90 mm, Pitch 0.95 mm; Mounting Technology: Surface Mount; DatasheetVersion: SLVS348K; Part Number: TPS79318DBVR; ComponentLink1Description: Manufacturer URL; ComponentLink2Description: Datasheet; PackageReference: DBV0005A; Iout(Max)(A): 0.2; Fixed Output Options(V): 1.8; Vout Adj(Min)(V): 1.8; Code_JEDEC: MO-178; ComponentLink1URL: http://www.ti.com/; ComponentLink2URL: http://www.ti.com/general/docs/lit/getliterature.tsp?genericPartNumber=TPS79318&fileType=pdf
U18 = CMP-0188-00351-3: IC ADC 10BIT SAR 16SOIC; Resolution: 10b; Output Voltage: 4.1V; Number of Channels: 8; Number of Elements: 1; Number of Bits: 10; Full Scale Error: 1LSB; Signal to Noise Ratio (SNR): 200dB; Interface: SPI; Nominal Supply Current: 425uA; Sampling Rate: 200KS/s; Supply Type: Single; Min Supply Voltage: 2.7V; Max Supply Voltage: 5.5V; Operating Supply Voltage: 5V; Polarity: Unipolar; Min Operating Temperature: -40°C; REACH SVHC: No SVHC; Integral Nonlinearity (INL): 1LSB; Mount: Surface Mount; Number of Converters: 1; Differential Nonlinearity: 1LSB; Contact Plating: Tin; Lead Free: Lead Free; Conversion Rate: 200KS/s; Radiation Hardening: No; Max Operating Temperature: 85°C; Case/Package: SOIC; Package Quantity: 2600; Number of Pins: 16; Packaging: Tape and Reel; Number of A/D Converters: 1; Part Number: MCP3008T-I/SL
VR1 = CMP-1747-00004-1: Square Trimpot(R) Trimming Potentiometer, 10 KOhm, 300 V, -55 to 125 degC, 3-Pin THD, RoHS, Tube; Voltage Rating: 220 mV; Power Rating: 1 W; Tolerance: 1%; Resistance: 50 mohm; Case/Package: 1206; Length: 3.2 mm; RoHSCompliant: True; PackageDescription: 3-Pin Through Hole Device, Body 6.6 x 6.99 mm, Pitch 2.54 mm; ComponentLink2Description: Datasheet; REACH SVHC: No SVHC; Mount: Surface Mount; Height: 0.6 mm; Packaging: Tape and Reel; ComponentLink1URL: http://www.bourns.com/; Case Code (Imperial): 0612; Pins: 2; Case Code (Metric): 1632; ComponentLink2URL: http://www.bourns.com/docs/Product-Datasheets/3362.pdf; Min Operating Temperature: -25degC; ComponentLink1Description: Manufacturer URL; PackageReference: 3326P; Max Operating Temperature: 125degC; Width: 1.6 mm; Package Quantity: 5000; DatasheetVersion: May-16; Part Number: 3362P-1-103LF